# EasyEDA Pro project STM32F103C8T6_C6T6核心板.eprj, board PCB3_视频里焊接测试版
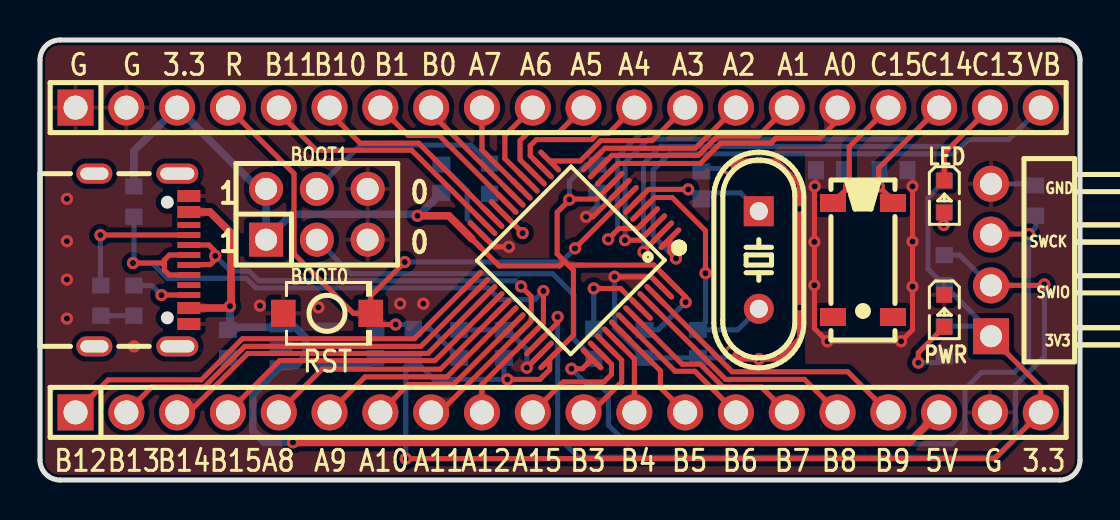
[diagram p8: board, top side]
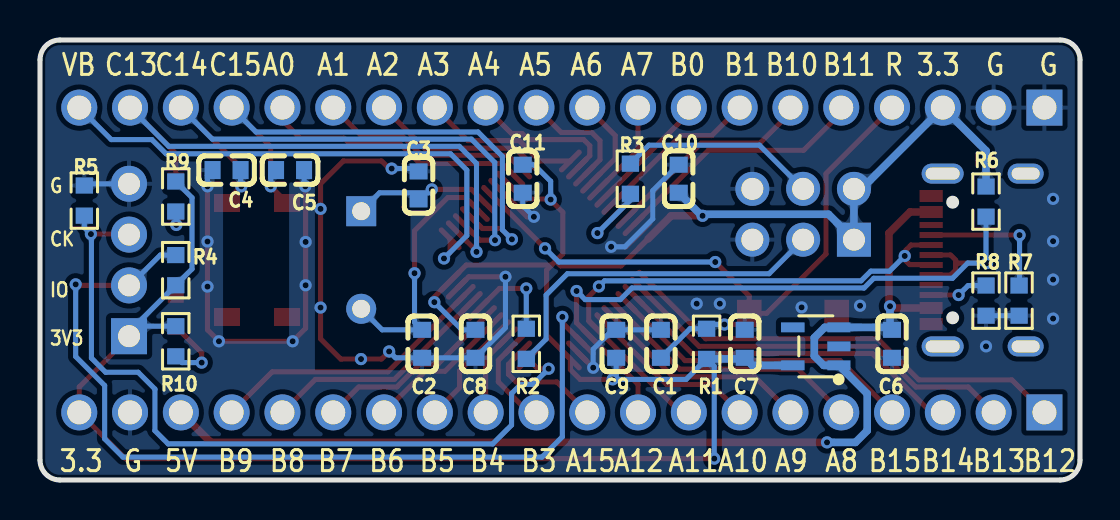
[diagram p9: board, bottom side, seen from below]

Outline 52 x 22 mm; copper layers: Top Layer, Bottom Layer. Coordinates in mm from the lower left corner of the outline.
Outline path: 0,21 0,1 arc(0.29,0.29) 1,0 51,0 arc(51.71,0.29) 52,1 52,21 arc(51.71,21.71) 51,22 1,22 arc(0.29,21.71) 0,21
Stack: Top Layer 0.035mm / Dielectric1 1.51mm FR4 er 4.5 / Bottom Layer 0.035mm

## Design rules (mm)
template: JLCPCB Capability(Two Layers Board)
spacing copperThickness1oz (default): track to track 0.102, other pairs 0.152 to 0.3
spacing copperThickness2oz: track to track 0.203, other pairs 0.152 to 0.3
track width copperThickness1oz (default): min 0.127, default 0.254, max 2.54
track width copperThickness2oz: min 0.203, default 0.254, max 2.54
differential pair differentialPair (default): width min 0.127, default 0.254, max 2.54; gap min 0.152, default 0.152
via viaSize (default): diameter min 0.5, default 0.61, max 10; hole min 0.3, default 0.305, max 6.3

## Placement (name value [footprint] x y rotation side)
C1  1uF  [C0603]  20.96 6.81 270 bottom
C2  30pF  [C0603]  32.89 6.81 90 bottom
C3  30pF  [C0603]  33.07 14.73 270 bottom
C4  20pF  [C0603]  42.67 15.5 180 bottom
C5  20pF  [C0603]  39.5 15.5 0 bottom
C6  1uF  [C0603]  9.4 6.81 90 bottom
C7  1uF  [C0603]  16.76 6.81 270 bottom
C8  100nF  [C0603]  30.23 6.81 90 bottom
C9  100nF  [C0603]  23.19 6.81 270 bottom
C10  100nF  [C0603]  20.07 15.06 270 bottom
C11  100nF  [C0603]  27.86 15.06 90 bottom
H1  PZ254V-12-6P  [HDR-TH_6P-P2.54-V-M-R2-C3-S2.54]  13.84 13.29 0 top
H2  PZ254R-11-04P  [HDR-TH_4P-P2.54-H-M-W10.4]  47.55 11 90 top
J1  2.54-1*20P直针  [HDR-TH_20P-P2.54-V-M-1]  25.91 3.38 0 top
J2  2.54-1*20P直针  [HDR-TH_20P-P2.54-V-M-1]  25.91 18.62 0 top
LDO1  ME6211C33M5G-N  [SOT-23-5_L3.0-W1.7-P0.95-LS2.8-BL]  13.21 6.68 90 bottom
LED1  LTST-C190KSKT  [LED0603-RD]  45.21 14.17 270 top
LED2  LTST-C190KSKT  [LED0603-RD]  45.21 8.46 270 top
R1  10kΩ  [R0603]  18.67 6.81 270 bottom
R2  100kΩ  [R0603]  27.69 6.81 270 bottom
R3  100kΩ  [R0603]  22.48 15.06 270 bottom
R4  10kΩ  [R0603]  45.21 10.49 270 bottom
R5  10kΩ  [R0603]  49.78 13.97 270 bottom
R6  1.5kΩ  [R0603]  4.7 13.92 270 bottom
R7  5.1kΩ  [R0603]  3.05 8.97 270 bottom
R8  5.1kΩ  [R0603]  4.7 8.97 270 bottom
R9  510Ω  [R0603]  45.21 14.17 90 bottom
R10  510Ω  [R0603]  45.21 6.94 90 bottom
SW1  TS-1088-AR02016  [SW-SMD_L3.9-W3.0-P4.45]  14.35 8.33 0 top
U1  STM32F103C8T6  [LQFP-48_L7.0-W7.0-P0.50-LS9.0-BL]  26.54 11 135 top
USB1  TYPE-C 16P(073)  [USB-C-SMD_TYPE-C16PIN_C668624]  5.08 11 270 top
X1  8MHz  [HC-49US_L11.5-W4.5-P4.88]  35.94 11 270 top
X2  32.768kHz  [MC-306_4P-L8.0-W3.2-P5.5-BL]  41.15 11 270 top

## Footprints (pads in the part's own frame, mm; a bottom-side part is the same pattern mirrored in y, then rotated)
C0603
  rect 0.8x0.9 smd: 1(-0.7,0) 2(0.7,0)
HC-49US_L11.5-W4.5-P4.88
  rect 1.5x1.5 hole 0.9: 1(-2.44,0)
  round 1.5 hole 0.9: 2(2.44,0)
HDR-TH_4P-P2.54-H-M-W10.4
  rect 1.8x1.8 hole 1.1: 1(-3.81,0)
  round 1.8 hole 1.1: 2(-1.27,0) 3(1.27,0) 4(3.81,0)
HDR-TH_6P-P2.54-V-M-R2-C3-S2.54
  rect 1.7x1.7 hole 1.1: 1(-2.54,-1.27)
  round 1.7 hole 1.1: 2(-2.54,1.27) 3(0,-1.27) 4(0,1.27) 5(2.54,-1.27) 6(2.54,1.27)
HDR-TH_20P-P2.54-V-M-1
  rect 1.8x1.8 hole 1.2: 1(-24.13,0)
  round 1.8 hole 1.2: 2(-21.59,0) 3(-19.05,0) 4(-16.51,0) 5(-13.97,0) 6(-11.43,0) 7(-8.89,0) 8(-6.35,0) 9(-3.81,0) 10(-1.27,0) 11(1.27,0) 12(3.81,0) 13(6.35,0) 14(8.89,0) 15(11.43,0) 16(13.97,0) 17(16.51,0) 18(19.05,0) 19(21.59,0) 20(24.13,0)
LED0603-RD
  rect 0.8x0.8 smd: 1(-0.799,0) 2(0.799,0)
LQFP-48_L7.0-W7.0-P0.50-LS9.0-BL
  oval 0.27x1.5 smd: 1(-2.75,-4.25) 2(-2.25,-4.25) 3(-1.75,-4.25) 4(-1.25,-4.25) 5(-0.75,-4.25) 6(-0.25,-4.25) 7(0.25,-4.25) 8(0.75,-4.25) 9(1.25,-4.25) 10(1.75,-4.25) 11(2.25,-4.25) 12(2.75,-4.25) 25(2.75,4.25) 26(2.25,4.25) 27(1.75,4.25) 28(1.25,4.25) 29(0.75,4.25) 30(0.25,4.25) 31(-0.25,4.25) 32(-0.75,4.25) 33(-1.25,4.25) 34(-1.75,4.25) 35(-2.25,4.25) 36(-2.75,4.25)
  oval 1.5x0.27 smd: 13(4.25,-2.75) 14(4.25,-2.25) 15(4.25,-1.75) 16(4.25,-1.25) 17(4.25,-0.75) 18(4.25,-0.25) 19(4.25,0.25) 20(4.25,0.75) 21(4.25,1.25) 22(4.25,1.75) 23(4.25,2.25) 24(4.25,2.75) 37(-4.25,2.75) 38(-4.25,2.25) 39(-4.25,1.75) 40(-4.25,1.25) 41(-4.25,0.75) 42(-4.25,0.25) 43(-4.25,-0.25) 44(-4.25,-0.75) 45(-4.25,-1.25) 46(-4.25,-1.75) 47(-4.25,-2.25) 48(-4.25,-2.75)
MC-306_4P-L8.0-W3.2-P5.5-BL
  rect 0.9x1.3 smd: 1(-2.85,-1.5) 2(2.85,-1.5) 3(2.85,1.5) 4(-2.85,1.5)
R0603
  rect 0.806x0.864 smd: 1(-0.753,0) 2(0.753,0)
SOT-23-5_L3.0-W1.7-P0.95-LS2.8-BL
  rect 0.49x1.157 smd: 1(-0.95,-1.153) 2(0,-1.153) 3(0.95,-1.153)
  rect 0.49x1.175 smd: 4(0.95,1.153) 5(-0.95,1.153)
SW-SMD_L3.9-W3.0-P4.45
  rect 1.23x1.36 smd: 1(-2.185,0) 2(2.185,0)
USB-C-SMD_TYPE-C16PIN_C668624
  oval 1x2.1 hole 0.6x1.7: 1(-4.32,1.788) 2(4.32,1.788)
  oval 1x1.8 hole 0.6x1.4: 3(-4.32,-2.362) 4(4.32,-2.362)
  rect 0.6x1.15 smd: A1B12(-3.2,2.362) A4B9(-2.4,2.362) B1A12(3.2,2.362) B4A9(2.4,2.362)
  rect 0.3x1.15 smd: A5(-1.25,2.362) A6(-0.25,2.362) A7(0.25,2.362) A8(1.25,2.362) B5(1.75,2.362) B6(0.75,2.362) B7(-0.75,2.362) B8(-1.75,2.362)

## Nets
As in the schematic.

Pads without a net: LDO1 4; USB1 1 2 3 4 A8 B8; X2 2 3

## Via types
v1: diameter 0.61, hole 0.305, Top Layer to Bottom Layer, 58 vias

## Routing (per net, layer and track width the routed paths; a pad name or vN(x,y) marks a point on that pad's centre or on a via; arc(x,y) is an arc through that point)
3V3: length 123.6
  Top Layer w0.254: 26.21,10.95 25.86,11.31 25.86,13.39 26.49,14.02 ; 26.21,10.95 25.97,10.7 22.95,10.7 U1.24 ; 26.21,10.95 26.42,10.75 ; 47.5,7.19 50.04,4.65 J1.20 47.73,1.07 v1(18.29,1.07) ; v1(32.28,8.89) 32.28,9.15 U1.48 30.69,10.75 26.42,10.75 ; 26.42,10.75 26.67,10.49 26.67,7.24 U1.36 25.48,5.52 24.99,5.03 v1(23.37,5.03) ; 26.52,14.05 27.82,14.05 28.66,14.89
  Top Layer w0.381: v1(18.87,13.21) 20.44,13.21 U1.24
  Bottom Layer w0.254: C8.2 30.9,7.51 v1(32.28,8.89) ; C9.2 23.19,5.21 v1(23.37,5.03) 19.69,5.03 R1.2 18.29,5.67 v1(18.29,1.07) ; R9.2 44.4,14.12 44.4,10.55 R4.2 47.5,7.45 47.5,7.19 47,7.69 R10.2 ; 18.87,13.29 v1(18.87,13.21) ; C11.2 27.29,15.76 26.47,14.94 v1(26.47,14.02)
  Bottom Layer w0.381: R1.2 16.82,6.06 C7.2 16.39,5.73 LDO1.5 ; v1(18.87,13.21) 18.91,13.21 C10.2 ; 18.87,13.29 12.57,13.29 H1.1 H1.2 10.92,14.56 J2.3 4.7,16.46 R6.1
5V: length 55
  Top Layer w0.381: J1.18 43.46,1.88 v1(12.65,1.88) ; USB1.A4B9 8.5,13.4 9.55,12.35 9.55,8.6 USB1.B4A9
  Bottom Layer w0.381: 9.5,7.61 9.52,7.63 LDO1.3 12.77,7.63 13.28,7.11 13.28,6.2 12.82,5.73 LDO1.1 10.64,4.32 10.64,2.47 11.23,1.88 v1(12.65,1.88) ; 9.5,7.61 v1(9.5,8.69) ; 9.5,7.61 C6.2
GND: length 71.8
  Top Layer w0.254: U1.35 v1(24.34,5.61) ; v1(23.44,11.66) 22.7,11.66 21.95,12.41 ; v1(34.54,6.43) 34.93,6.05 v1(35.95,6.05) 36.96,6.05 37.97,7.06 v1(37.97,8.62) v1(37.97,13.56) 37.97,14.81 36.83,15.95 34.93,15.95 34.54,15.57 v1(34.42,15.57) ; v1(43.63,14.68) v1(43.63,11.92) v1(43.63,9.67) 43.63,7.51 v1(43.05,6.94) v1(39.37,6.94) 38.72,7.58 v1(38.72,9.74) v1(38.72,11.9) 38.72,14.42 38.74,14.43 v1(38.74,14.68) ; v1(27.31,13.16) 27.64,13.16 U1.8 ; U1.47 30.56,10.16 v1(28.73,10.16)
  Bottom Layer w0.254: v1(38.74,14.68) 38.8,14.75 38.8,15.5 ; v1(28.73,10.16) 28.73,7.61 C8.1 C2.1 34.22,6.11 v1(34.54,6.43) ; v1(24.34,5.61) 24.34,6.54 23.37,7.51 C1.1 ; 49.78,14.72 49.7,14.81 H2.4 ; C10.1 21.36,14.47 21.36,13.06 22.76,11.66 v1(23.44,11.66) ; R7.2 R8.2 ; v1(27.31,13.16) 27.86,13.72 C11.1 ; v1(43.63,14.68) 43.63,15.24 C4.1 ; v1(34.42,15.57) 32.96,15.57
  vias: v1(1.35,14.06) v1(1.35,11.94) v1(1.35,10.02) v1(1.35,8.07) v1(4.7,6.68) v1(11,8.71) v1(13.92,8.63) v1(18.01,8.82) v1(19.16,8.82)
BOOT0: length 4.8
  Top Layer w0.254: 30.08,8.53 29.03,9.58 v1(27.69,9.58)
  Bottom Layer w0.254: R2.1 v1(27.69,9.58)
BOOT1: length 4.2
  Top Layer w0.254: v1(24.13,12.35) 24.13,12.35 23.01,13.47
  Bottom Layer w0.254: R3.2 22.48,14 v1(24.13,12.35)
D+: length 35.9
  Top Layer w0.254: USB1.A6 6.47,11.25 6.22,11 6.22,10.72 ; v1(4.65,10.85) 6.09,10.85 6.22,10.72 ; 6.22,10.72 6.22,10.49 6.46,10.25 USB1.B6 ; J1.9 22.1,4.79 24.42,7.11 25.17,7.86 v1(25.17,9.45)
  Bottom Layer w0.254: v1(25.17,9.45) 24.74,9.02 22.99,9.02 22.4,9.6 10.8,9.6 10.31,10.09 6.38,10.09 5.61,10.85 4.75,10.85 4.7,10.9 ; 4.7,10.9 v1(4.65,10.85) ; 4.7,10.9 R6.2
D-: length 28
  Top Layer w0.254: USB1.B7 8.44,11.75 8.7,11.5 8.7,10.95 8.52,10.77 7.46,10.77 USB1.A7 ; J1.8 19.98,3.38 U1.32 24.56,7.96 24.56,9.17 v1(24.05,9.68)
  Bottom Layer w0.254: v1(24.05,9.68) 23.78,9.96 10.94,9.96 10.46,10.44 9.52,10.44 v1(8.76,11.2)
OSC32_IN: length 29.7
  Top Layer w0.254: J2.18 41.94,15.6 v1(41.94,14.68) 42.65,13.97 X2.4 ; v1(29.25,11.99) 30.01,11.99 U1.3
  Bottom Layer w0.254: v1(41.94,14.68) 41.97,14.72 C4.2 ; J2.18 43.38,17.05 30.43,17.05 29.26,15.88 29.26,12 v1(29.25,11.99)
OSC32_OUT: length 28.2
  Top Layer w0.254: U1.4 29.89,12.58 28.95,12.58 v1(28.41,12.03) ; X2.1 39.65,13.87 v1(40.46,14.68) 40.46,16.66 J2.17
  Bottom Layer w0.254: v1(40.46,14.68) 40.46,15.23 C5.2 ; v1(28.41,12.03) 28.88,12.51 28.88,16.18 30.1,17.4 41.2,17.4 J2.17
OSC_IN: length 12.7
  Top Layer w0.254: 30.08,13.47 30.73,14.12 31.61,14.12 33.27,12.46 v1(33.27,10.34)
  Bottom Layer w0.254: X1.2 34.89,7.51 C2.2 33.27,7.89 v1(33.27,10.34)
OSC_OUT: length 7
  Top Layer w0.254: v1(32.41,14.53) 30.43,14.53 U1.6
  Bottom Layer w0.254: X1.1 35.02,14.36 32.58,14.36 v1(32.41,14.53)
PA0: length 13.3
  Top Layer w0.254: U1.10 28.89,15.83 33.01,15.83 34.03,16.84 36.55,16.84 36.8,17.1 38.99,17.1 39.88,17.98 J2.16
PA1: length 10.6
  Top Layer w0.254: 27.96,15.6 28.59,16.23 32.91,16.23 33.88,17.2 35.92,17.2 J2.15
PA2: length 8.3
  Top Layer w0.254: U1.12 28.24,16.59 32.77,16.59 J2.14
PA3: length 7.9
  Top Layer w0.254: U1.13 27.02,15.95 28.04,16.97 30.61,16.97 J2.13
PA4: length 7.4
  Top Layer w0.254: J2.12 28.42,17.33 27.89,17.33 27.58,17.02 24.82,17.02 24.51,16.72 24.51,16.21 U1.14
PA5: length 5.9
  Top Layer w0.254: J2.11 25.93,17.38 24.41,17.38 24,16.97 24,16.02 U1.15
PA6: length 4.8
  Top Layer w0.254: J2.10 23.24,17.22 23.24,16.07 24.42,14.89
PA7: length 4.9
  Top Layer w0.254: U1.17 22.1,16.51 J2.9
PA8: length 13.2
  Top Layer w0.254: J1.5 14.1,5.54 20.02,5.54 23.01,8.53
PA9: length 10.9
  Top Layer w0.254: J1.6 16.26,5.16 20.35,5.16 23.36,8.17
PA10: length 8.5
  Top Layer w0.254: J1.7 18.41,4.78 20.67,4.78 U1.31
PA13: length 45.5
  Top Layer w0.254: v1(25.88,8.16) 25.88,7.86 U1.34 ; 47.5,9.73 50.16,9.73 v1(50.22,9.78)
  Bottom Layer w0.254: v1(50.22,9.78) 50.22,6.17 48.77,4.73 48.77,2.06 47.85,1.14 26.9,1.14 25.88,2.16 v1(25.88,8.16) ; R4.1 45.98,11.25 47.5,9.73
PA14: length 38.8
  Top Layer w0.254: v1(26.57,5.56) 27.12,5.56 U1.37 ; 47.5,12.27 47.53,12.3 v1(49.45,12.3)
  Bottom Layer w0.254: v1(26.57,5.56) 27.35,4.78 27.96,4.78 28.42,4.32 28.42,2.75 29.36,1.81 45.59,1.81 46.25,2.47 46.25,4.55 47.09,5.39 48.72,5.39 49.43,6.1 49.43,12.27 v1(49.45,12.3) 49.78,12.63 R5.2
PA15: length 6.1
  Top Layer w0.254: 27.96,6.4 28.57,5.79 28.57,5.28 28.19,4.9 26.16,4.9 J1.10
PB0: length 6.2
  Top Layer w0.254: J2.8 19.56,18.34 U1.18
PB1: length 8.3
  Top Layer w0.254: 23.36,13.83 19.97,17.22 18.41,17.22 J2.7
PB3: length 4.7
  Top Layer w0.254: J1.11 27.56,3.38 29.08,4.9 29.08,5.98 U1.39
PB4: length 4.2
  Top Layer w0.254: J1.12 29.72,6.06 28.66,7.11
PB5: length 5.4
  Top Layer w0.254: U1.41 31.02,5.46 31.02,4.62 J1.13
PB6: length 7.3
  Top Layer w0.254: J1.14 32.74,5.44 31.75,5.44 U1.42
PB7: length 9.6
  Top Layer w0.254: J1.15 36.07,4.65 34.16,4.65 33.01,5.79 32.1,5.79 U1.43
PB8: length 11.7
  Top Layer w0.254: U1.45 34.28,5.03 38.23,5.03 J1.16
PB9: length 14.1
  Top Layer w0.254: U1.46 34.61,5.41 40.39,5.41 J1.17
PB10: length 10.6
  Top Layer w0.254: J2.6 14.48,18.37 16,16.84 18.93,16.84 U1.21
PB11: length 12.9
  Top Layer w0.254: U1.22 18.58,16.49 13.82,16.49 11.94,18.37 J2.5
PB12: length 22.5
  Top Layer w0.254: J1.1 3.4,5.01 8.06,5.01 10.12,7.06 18.72,7.06 U1.25
PB13: length 20.2
  Top Layer w0.254: 21.95,9.59 19.04,6.68 10.24,6.68 8.21,4.65 5.59,4.65 J1.2
PB14: length 17.9
  Top Layer w0.254: J1.3 7.44,3.38 10.39,6.33 19.39,6.33 U1.27
PB15: length 15.5
  Top Layer w0.254: J1.4 11.99,5.97 19.75,5.97 U1.28
PC13: length 28.8
  Top Layer w0.254: J2.19 45.21,16.33 LED1.1 ; 30.18,11.51 30.23,11.51 U1.2
  Bottom Layer w0.254: J2.19 45.56,16.68 31.03,16.68 30.18,15.83 v1(30.18,11.41)
RST: length 34.9
  Top Layer w0.254: v1(17.78,7.77) 17.09,7.77 SW1.2 ; U1.7 29.35,14.18 v1(26.75,11.58) ; v1(18.24,10.9) 16.54,9.2 SW1.2 ; SW1.2 15.67,8.33 12.7,11.31 12.7,15.32 J2.4
  Bottom Layer w0.254: v1(17.78,7.77) 18.46,7.77 R1.1 19.5,7.56 C1.2 ; v1(18.24,10.9) 26.06,10.9 v1(26.75,11.58)
VB: length 26.7
  Top Layer w0.254: U1.1 31.49,11.38 v1(31.8,11.08)
  Bottom Layer w0.254: J2.20 48.44,17.02 46.41,17.02 45.69,16.31 31.47,16.31 30.66,15.5 30.66,12.22 v1(31.8,11.08)
$1N4238: length 17.6
  Bottom Layer w0.254: H1.3 15.54,10.31 25.63,10.31 26.7,9.25 26.7,7.05 R2.2
$1N4239: length 9.9
  Bottom Layer w0.254: H1.4 16.03,16.74 21.56,16.74 R3.1
$1N4255: length 2.9
  Top Layer w0.254: v1(6.07,9.25) 6.07,9.25 USB1.B5
  Bottom Layer w0.254: v1(6.07,9.25) 5.6,9.72 R8.1
$1N4256: length 7
  Top Layer w0.254: v1(3.02,12.24) 3.03,12.25 USB1.A5
  Bottom Layer w0.254: R7.1 3.02,9.75 v1(3.02,12.24)
$1N4263: length 3.8
  Top Layer w0.254: LED2.2 43.92,6.36 v1(43.92,5.87)
  Bottom Layer w0.254: v1(43.92,5.87) 44.9,5.87 R10.1
$1N4468: length 1.3
  Top Layer w0.254: v1(45.19,12.75) 45.19,13.35 LED1.2
  Bottom Layer w0.254: v1(45.19,12.75) 45.19,13.4 R9.1

## Copper pours and planes (outline as drawn; the poured copper is in the pictures)
GND on Top Layer: -2.79,24.82 54.69,24.82 54.69,-3.3 -2.79,-3.3
GND on Bottom Layer: -1.58,23.85 56.84,23.85 56.84,-1.98 -1.58,-1.98

Small or netless copper shapes (teardrops, artwork), in the pictures only: 117 on Top Layer, 113 on Bottom Layer

## Text on the board
Bottom Silkscreen Layer: G | CK | IO | 3V3 | 3.3 | R | B11 | B10 | B1 | B0 | A7 | A6 | A5 | A4 | A3 | A2 | A1 | A0 | C15 | C14 | C13 | VB | B12 | B13 | B14 | B15 | A8 | A9 | A10 | A11 | A12 | A15 | B3 | B4 | B5 | B6 | B7 | B8 | B9 | 5V
Top Silkscreen Layer: SWCK | SWIO | 3V3 | GND | BOOT1 | BOOT0 | PWR | LED | B12 | G | B13 | B14 | 3.3 | B15 | R | A8 | B11 | RST | B10 | A9 | A10 | B1 | A11 | B0 | A12 | A7 | A15 | A6 | A5 | B3 | A4 | B4 | A3 | B5 | A2 | B6 | B7 | A1 | B8 | A0 | C15 | B9 | C14 | 5V | C13 | VB | 1 | 0
